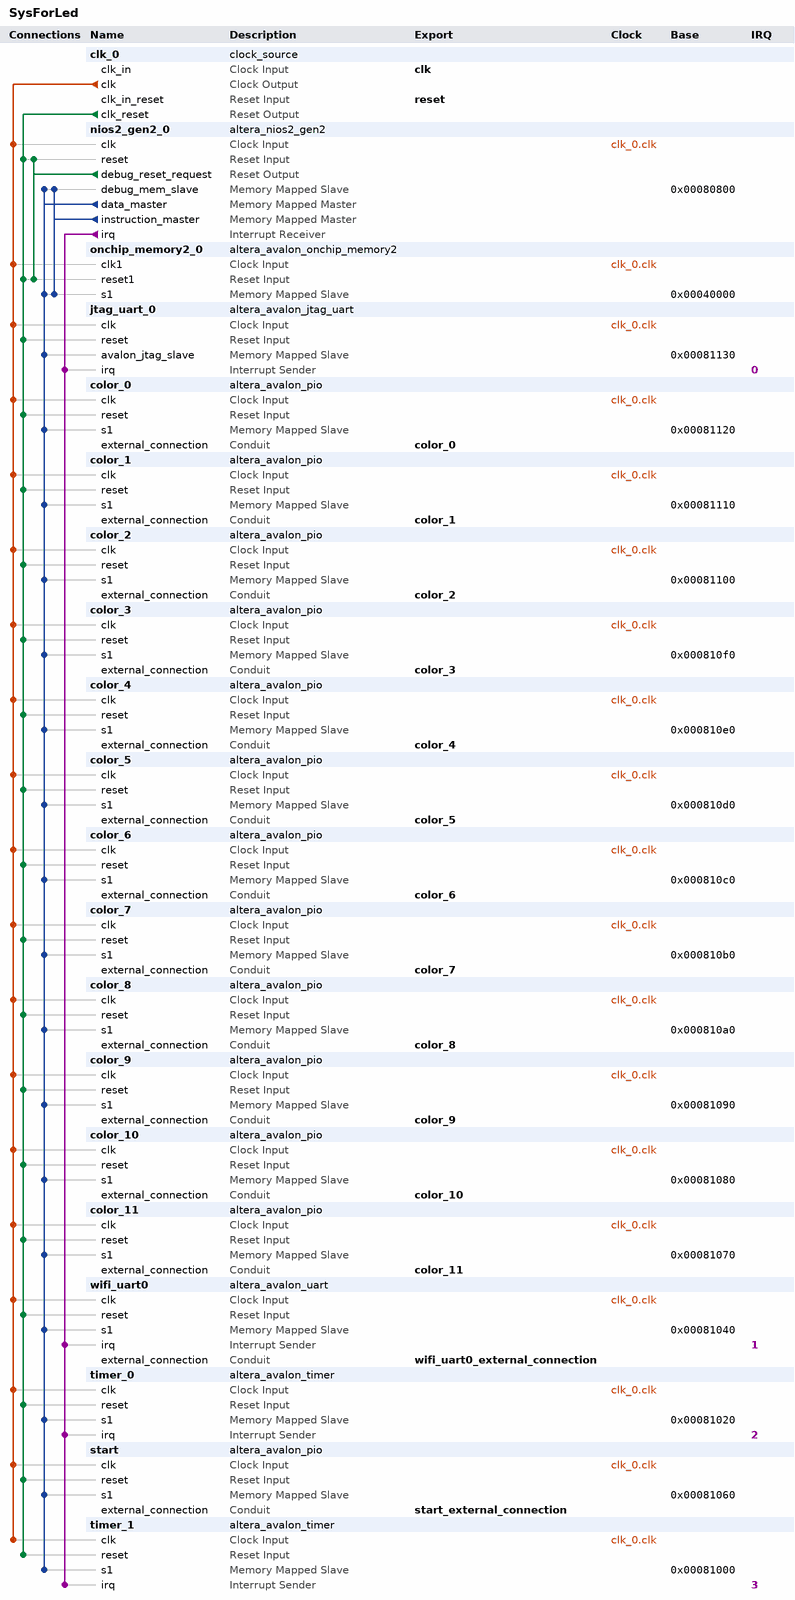
[diagram p0: system contents]
# Platform Designer (Qsys) system SysForLed, Cyclone V 5CSEMA5F31C6
# Parameters at their usual value, and those the tool derives, are not listed.
package require -exact qsys 19.1
create_system SysForLed
set_project_property DEVICE_FAMILY {Cyclone V}
set_project_property DEVICE 5CSEMA5F31C6

add_instance clk_0 clock_source 19.1
set_instance_parameter_value clk_0 clockFrequency 50000000

add_instance nios2_gen2_0 altera_nios2_gen2 19.1
set_instance_parameter_value nios2_gen2_0 dcache_size 2048
set_instance_parameter_value nios2_gen2_0 exceptionSlave onchip_memory2_0.s1
set_instance_parameter_value nios2_gen2_0 icache_size 4096
set_instance_parameter_value nios2_gen2_0 impl Fast
set_instance_parameter_value nios2_gen2_0 resetSlave onchip_memory2_0.s1

add_instance onchip_memory2_0 altera_avalon_onchip_memory2 19.1
set_instance_parameter_value onchip_memory2_0 dataWidth 32
set_instance_parameter_value onchip_memory2_0 dualPort false
set_instance_parameter_value onchip_memory2_0 initMemContent true
set_instance_parameter_value onchip_memory2_0 initializationFileName onchip_mem.hex
set_instance_parameter_value onchip_memory2_0 memorySize 262144

add_instance jtag_uart_0 altera_avalon_jtag_uart 19.1
set_instance_parameter_value jtag_uart_0 simInteractiveOptions NO_INTERACTIVE_WINDOWS

add_instance color_0 altera_avalon_pio 19.1
set_instance_parameter_value color_0 direction Output
set_instance_parameter_value color_0 width 24

add_instance color_1 altera_avalon_pio 19.1
set_instance_parameter_value color_1 direction Output
set_instance_parameter_value color_1 width 24

add_instance color_2 altera_avalon_pio 19.1
set_instance_parameter_value color_2 direction Output
set_instance_parameter_value color_2 width 24

add_instance color_3 altera_avalon_pio 19.1
set_instance_parameter_value color_3 direction Output
set_instance_parameter_value color_3 width 24

add_instance color_4 altera_avalon_pio 19.1
set_instance_parameter_value color_4 direction Output
set_instance_parameter_value color_4 width 24

add_instance color_5 altera_avalon_pio 19.1
set_instance_parameter_value color_5 direction Output
set_instance_parameter_value color_5 width 24

add_instance color_6 altera_avalon_pio 19.1
set_instance_parameter_value color_6 direction Output
set_instance_parameter_value color_6 width 24

add_instance color_7 altera_avalon_pio 19.1
set_instance_parameter_value color_7 direction Output
set_instance_parameter_value color_7 width 24

add_instance color_8 altera_avalon_pio 19.1
set_instance_parameter_value color_8 direction Output
set_instance_parameter_value color_8 width 24

add_instance color_9 altera_avalon_pio 19.1
set_instance_parameter_value color_9 direction Output
set_instance_parameter_value color_9 width 24

add_instance color_10 altera_avalon_pio 19.1
set_instance_parameter_value color_10 direction Output
set_instance_parameter_value color_10 width 24

add_instance color_11 altera_avalon_pio 19.1
set_instance_parameter_value color_11 direction Output
set_instance_parameter_value color_11 width 24

add_instance wifi_uart0 altera_avalon_uart 19.1
set_instance_parameter_value wifi_uart0 baud 115200
set_instance_parameter_value wifi_uart0 dataBits 8
set_instance_parameter_value wifi_uart0 fixedBaud true
set_instance_parameter_value wifi_uart0 parity NONE
set_instance_parameter_value wifi_uart0 stopBits 1
set_instance_parameter_value wifi_uart0 useCtsRts true

add_instance timer_0 altera_avalon_timer 19.1
set_instance_parameter_value timer_0 fixedPeriod true
set_instance_parameter_value timer_0 period 10
set_instance_parameter_value timer_0 periodUnits MSEC

add_instance start altera_avalon_pio 19.1
set_instance_parameter_value start direction Output
set_instance_parameter_value start width 1

add_instance timer_1 altera_avalon_timer 19.1
set_instance_parameter_value timer_1 fixedPeriod true
set_instance_parameter_value timer_1 period 10
set_instance_parameter_value timer_1 periodUnits MSEC

# connections
add_connection clk_0.clk color_0.clk clock
add_connection clk_0.clk color_1.clk clock
add_connection clk_0.clk color_2.clk clock
add_connection clk_0.clk color_3.clk clock
add_connection clk_0.clk color_4.clk clock
add_connection clk_0.clk color_5.clk clock
add_connection clk_0.clk color_6.clk clock
add_connection clk_0.clk color_7.clk clock
add_connection clk_0.clk color_8.clk clock
add_connection clk_0.clk color_9.clk clock
add_connection clk_0.clk color_10.clk clock
add_connection clk_0.clk color_11.clk clock
add_connection clk_0.clk jtag_uart_0.clk clock
add_connection clk_0.clk nios2_gen2_0.clk clock
add_connection clk_0.clk onchip_memory2_0.clk1 clock
add_connection clk_0.clk start.clk clock
add_connection clk_0.clk timer_0.clk clock
add_connection clk_0.clk timer_1.clk clock
add_connection clk_0.clk wifi_uart0.clk clock
add_connection clk_0.clk_reset color_0.reset reset
add_connection clk_0.clk_reset color_1.reset reset
add_connection clk_0.clk_reset color_2.reset reset
add_connection clk_0.clk_reset color_3.reset reset
add_connection clk_0.clk_reset color_4.reset reset
add_connection clk_0.clk_reset color_5.reset reset
add_connection clk_0.clk_reset color_6.reset reset
add_connection clk_0.clk_reset color_7.reset reset
add_connection clk_0.clk_reset color_8.reset reset
add_connection clk_0.clk_reset color_9.reset reset
add_connection clk_0.clk_reset color_10.reset reset
add_connection clk_0.clk_reset color_11.reset reset
add_connection clk_0.clk_reset jtag_uart_0.reset reset
add_connection clk_0.clk_reset nios2_gen2_0.reset reset
add_connection clk_0.clk_reset onchip_memory2_0.reset1 reset
add_connection clk_0.clk_reset start.reset reset
add_connection clk_0.clk_reset timer_0.reset reset
add_connection clk_0.clk_reset timer_1.reset reset
add_connection clk_0.clk_reset wifi_uart0.reset reset
add_connection nios2_gen2_0.debug_reset_request nios2_gen2_0.reset reset
add_connection nios2_gen2_0.debug_reset_request onchip_memory2_0.reset1 reset
add_connection nios2_gen2_0.data_master color_0.s1 avalon
set_connection_parameter_value nios2_gen2_0.data_master/color_0.s1 baseAddress 0x00081120
add_connection nios2_gen2_0.data_master color_1.s1 avalon
set_connection_parameter_value nios2_gen2_0.data_master/color_1.s1 baseAddress 0x00081110
add_connection nios2_gen2_0.data_master color_2.s1 avalon
set_connection_parameter_value nios2_gen2_0.data_master/color_2.s1 baseAddress 0x00081100
add_connection nios2_gen2_0.data_master color_3.s1 avalon
set_connection_parameter_value nios2_gen2_0.data_master/color_3.s1 baseAddress 0x000810f0
add_connection nios2_gen2_0.data_master color_4.s1 avalon
set_connection_parameter_value nios2_gen2_0.data_master/color_4.s1 baseAddress 0x000810e0
add_connection nios2_gen2_0.data_master color_5.s1 avalon
set_connection_parameter_value nios2_gen2_0.data_master/color_5.s1 baseAddress 0x000810d0
add_connection nios2_gen2_0.data_master color_6.s1 avalon
set_connection_parameter_value nios2_gen2_0.data_master/color_6.s1 baseAddress 0x000810c0
add_connection nios2_gen2_0.data_master color_7.s1 avalon
set_connection_parameter_value nios2_gen2_0.data_master/color_7.s1 baseAddress 0x000810b0
add_connection nios2_gen2_0.data_master color_8.s1 avalon
set_connection_parameter_value nios2_gen2_0.data_master/color_8.s1 baseAddress 0x000810a0
add_connection nios2_gen2_0.data_master color_9.s1 avalon
set_connection_parameter_value nios2_gen2_0.data_master/color_9.s1 baseAddress 0x00081090
add_connection nios2_gen2_0.data_master color_10.s1 avalon
set_connection_parameter_value nios2_gen2_0.data_master/color_10.s1 baseAddress 0x00081080
add_connection nios2_gen2_0.data_master color_11.s1 avalon
set_connection_parameter_value nios2_gen2_0.data_master/color_11.s1 baseAddress 0x00081070
add_connection nios2_gen2_0.data_master jtag_uart_0.avalon_jtag_slave avalon
set_connection_parameter_value nios2_gen2_0.data_master/jtag_uart_0.avalon_jtag_slave baseAddress 0x00081130
add_connection nios2_gen2_0.data_master nios2_gen2_0.debug_mem_slave avalon
set_connection_parameter_value nios2_gen2_0.data_master/nios2_gen2_0.debug_mem_slave baseAddress 0x00080800
add_connection nios2_gen2_0.data_master onchip_memory2_0.s1 avalon
set_connection_parameter_value nios2_gen2_0.data_master/onchip_memory2_0.s1 baseAddress 0x00040000
add_connection nios2_gen2_0.data_master start.s1 avalon
set_connection_parameter_value nios2_gen2_0.data_master/start.s1 baseAddress 0x00081060
add_connection nios2_gen2_0.data_master timer_0.s1 avalon
set_connection_parameter_value nios2_gen2_0.data_master/timer_0.s1 baseAddress 0x00081020
add_connection nios2_gen2_0.data_master timer_1.s1 avalon
set_connection_parameter_value nios2_gen2_0.data_master/timer_1.s1 baseAddress 0x00081000
add_connection nios2_gen2_0.data_master wifi_uart0.s1 avalon
set_connection_parameter_value nios2_gen2_0.data_master/wifi_uart0.s1 baseAddress 0x00081040
add_connection nios2_gen2_0.instruction_master nios2_gen2_0.debug_mem_slave avalon
set_connection_parameter_value nios2_gen2_0.instruction_master/nios2_gen2_0.debug_mem_slave baseAddress 0x00080800
add_connection nios2_gen2_0.instruction_master onchip_memory2_0.s1 avalon
set_connection_parameter_value nios2_gen2_0.instruction_master/onchip_memory2_0.s1 baseAddress 0x00040000
add_connection nios2_gen2_0.irq jtag_uart_0.irq interrupt
set_connection_parameter_value nios2_gen2_0.irq/jtag_uart_0.irq irqNumber 0
add_connection nios2_gen2_0.irq timer_0.irq interrupt
set_connection_parameter_value nios2_gen2_0.irq/timer_0.irq irqNumber 2
add_connection nios2_gen2_0.irq timer_1.irq interrupt
set_connection_parameter_value nios2_gen2_0.irq/timer_1.irq irqNumber 3
add_connection nios2_gen2_0.irq wifi_uart0.irq interrupt
set_connection_parameter_value nios2_gen2_0.irq/wifi_uart0.irq irqNumber 1

# exported interfaces
add_interface clk clock sink
set_interface_property clk EXPORT_OF clk_0.clk_in
add_interface color_0 conduit end
set_interface_property color_0 EXPORT_OF color_0.external_connection
add_interface color_1 conduit end
set_interface_property color_1 EXPORT_OF color_1.external_connection
add_interface color_10 conduit end
set_interface_property color_10 EXPORT_OF color_10.external_connection
add_interface color_11 conduit end
set_interface_property color_11 EXPORT_OF color_11.external_connection
add_interface color_2 conduit end
set_interface_property color_2 EXPORT_OF color_2.external_connection
add_interface color_3 conduit end
set_interface_property color_3 EXPORT_OF color_3.external_connection
add_interface color_4 conduit end
set_interface_property color_4 EXPORT_OF color_4.external_connection
add_interface color_5 conduit end
set_interface_property color_5 EXPORT_OF color_5.external_connection
add_interface color_6 conduit end
set_interface_property color_6 EXPORT_OF color_6.external_connection
add_interface color_7 conduit end
set_interface_property color_7 EXPORT_OF color_7.external_connection
add_interface color_8 conduit end
set_interface_property color_8 EXPORT_OF color_8.external_connection
add_interface color_9 conduit end
set_interface_property color_9 EXPORT_OF color_9.external_connection
add_interface reset reset sink
set_interface_property reset EXPORT_OF clk_0.clk_in_reset
add_interface start_external_connection conduit end
set_interface_property start_external_connection EXPORT_OF start.external_connection
add_interface wifi_uart0_external_connection conduit end
set_interface_property wifi_uart0_external_connection EXPORT_OF wifi_uart0.external_connection

set_interconnect_requirement {$system} qsys_mm.clockCrossingAdapter HANDSHAKE
set_interconnect_requirement {$system} qsys_mm.enableEccProtection FALSE
set_interconnect_requirement {$system} qsys_mm.insertDefaultSlave FALSE
set_interconnect_requirement {$system} qsys_mm.maxAdditionalLatency 1

save_system SysForLed.qsys
